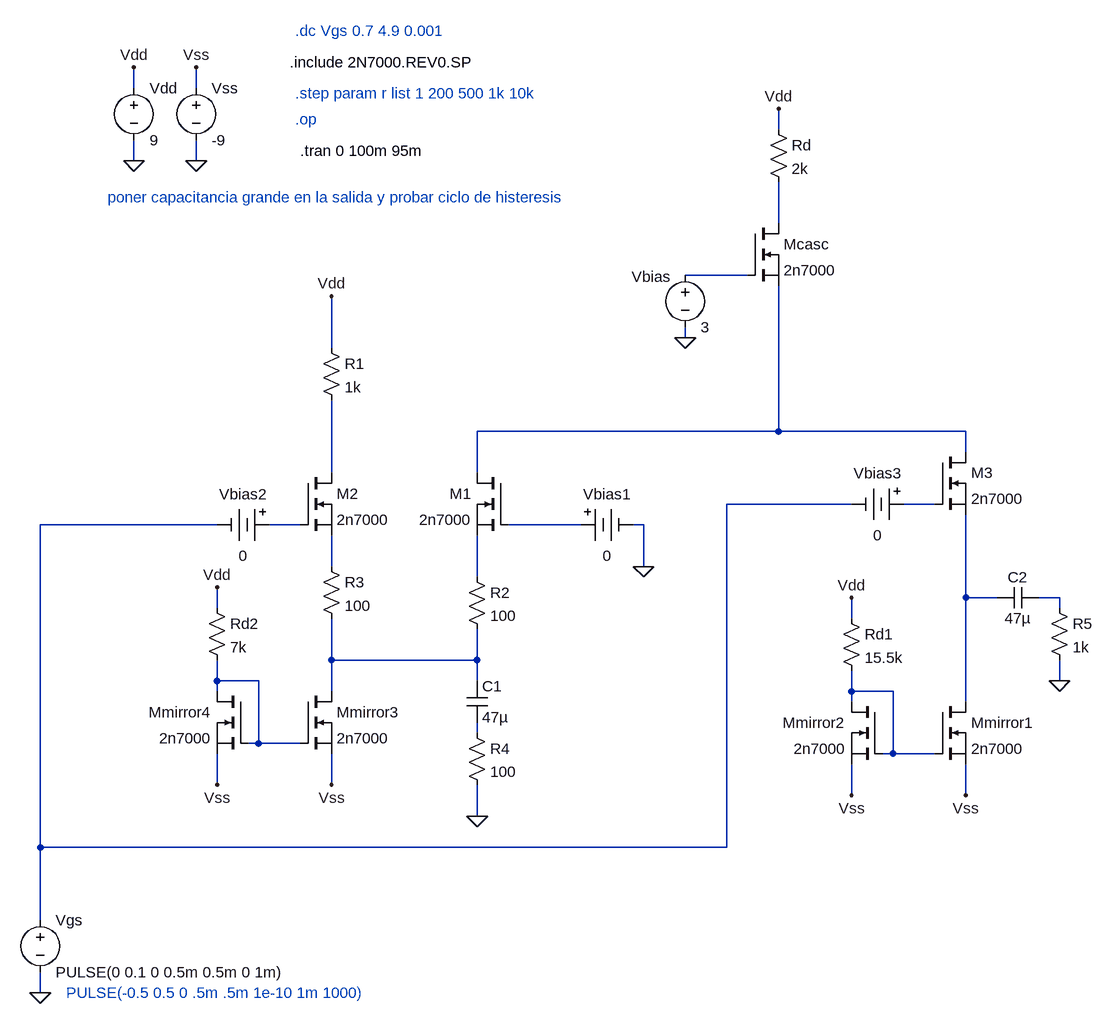
[diagram p0: schematic both gm.asc]
both gm.asc, the LTspice schematic file:
Version 4
SHEET 1 1940 1232
WIRE 400 -176 400 -208
WIRE 496 -176 496 -208
WIRE 1392 -112 1392 -144
WIRE 400 -64 400 -96
WIRE 496 -64 496 -96
WIRE 1392 32 1392 -32
WIRE 1344 112 1248 112
WIRE 1248 208 1248 192
WIRE 704 224 704 144
WIRE 1392 352 1392 128
WIRE 1392 352 928 352
WIRE 1680 352 1392 352
WIRE 1680 384 1680 352
WIRE 704 416 704 304
WIRE 928 416 928 352
WIRE 1504 464 1312 464
WIRE 1632 464 1584 464
WIRE 528 496 256 496
WIRE 656 496 608 496
WIRE 1088 496 976 496
WIRE 1184 496 1168 496
WIRE 704 560 704 512
WIRE 1184 560 1184 496
WIRE 928 576 928 512
WIRE 1680 608 1680 480
WIRE 1728 608 1680 608
WIRE 1824 608 1792 608
WIRE 528 624 528 592
WIRE 1824 624 1824 608
WIRE 1504 640 1504 608
WIRE 704 704 704 640
WIRE 928 704 928 656
WIRE 928 704 704 704
WIRE 528 736 528 704
WIRE 592 736 528 736
WIRE 928 736 928 704
WIRE 1824 736 1824 704
WIRE 528 752 528 736
WIRE 704 752 704 704
WIRE 1504 752 1504 720
WIRE 1568 752 1504 752
WIRE 1504 768 1504 752
WIRE 1680 768 1680 608
WIRE 928 816 928 800
WIRE 592 832 592 736
WIRE 592 832 576 832
WIRE 656 832 592 832
WIRE 1568 848 1568 752
WIRE 1568 848 1552 848
WIRE 1632 848 1568 848
WIRE 528 896 528 848
WIRE 704 896 704 848
WIRE 1504 912 1504 864
WIRE 1680 912 1680 864
WIRE 928 944 928 896
WIRE 256 992 256 496
WIRE 1312 992 1312 464
WIRE 1312 992 256 992
WIRE 256 1104 256 992
WIRE 256 1216 256 1184
FLAG 256 1216 0
FLAG 400 -64 0
FLAG 400 -208 Vdd
FLAG 1392 -144 Vdd
FLAG 1248 208 0
FLAG 496 -64 0
FLAG 496 -208 Vss
FLAG 528 592 Vdd
FLAG 528 896 Vss
FLAG 704 896 Vss
FLAG 704 144 Vdd
FLAG 1184 560 0
FLAG 928 944 0
FLAG 1504 608 Vdd
FLAG 1504 912 Vss
FLAG 1680 912 Vss
FLAG 1824 736 0
SYMBOL voltage 256 1088 R0
WINDOW 123 0 0 Left 2
WINDOW 39 0 0 Left 2
SYMATTR InstName Vgs
SYMATTR Value PULSE(0 0.1 0 0.5m 0.5m 0 1m)
SYMBOL voltage 400 -192 R0
WINDOW 123 0 0 Left 2
WINDOW 39 0 0 Left 2
SYMATTR InstName Vdd
SYMATTR Value 9
SYMBOL res 1376 -128 R0
SYMATTR InstName Rd
SYMATTR Value 2k
SYMBOL nmos 1344 32 R0
SYMATTR InstName Mcasc
SYMATTR Value 2n7000
SYMATTR Prefix X
SYMBOL voltage 1248 96 R0
WINDOW 0 -82 18 Left 2
WINDOW 123 0 0 Left 2
WINDOW 39 0 0 Left 2
SYMATTR InstName Vbias
SYMATTR Value 3
SYMBOL voltage 496 -192 R0
WINDOW 123 0 0 Left 2
WINDOW 39 0 0 Left 2
SYMATTR InstName Vss
SYMATTR Value -9
SYMBOL nmos 656 416 R0
SYMATTR InstName M2
SYMATTR Value 2n7000
SYMATTR Prefix X
SYMBOL battery 624 496 R90
WINDOW 0 -32 56 VBottom 2
WINDOW 3 32 56 VTop 2
SYMATTR InstName Vbias2
SYMATTR Value 0
SYMBOL nmos 656 752 R0
SYMATTR InstName Mmirror3
SYMATTR Value 2n7000
SYMATTR Prefix X
SYMBOL nmos 576 752 M0
SYMATTR InstName Mmirror4
SYMATTR Value 2n7000
SYMATTR Prefix X
SYMBOL res 512 608 R0
SYMATTR InstName Rd2
SYMATTR Value 7k
SYMBOL nmos 976 416 M0
SYMATTR InstName M1
SYMATTR Value 2n7000
SYMATTR Prefix X
SYMBOL res 688 208 R0
SYMATTR InstName R1
SYMATTR Value 1k
SYMBOL battery 1072 496 M90
WINDOW 0 -32 56 VBottom 2
WINDOW 3 32 56 VTop 2
SYMATTR InstName Vbias1
SYMATTR Value 0
SYMBOL res 912 560 R0
SYMATTR InstName R2
SYMATTR Value 100
SYMBOL res 688 544 R0
SYMATTR InstName R3
SYMATTR Value 100
SYMBOL cap 912 736 R0
SYMATTR InstName C1
SYMATTR Value 47µ
SYMBOL res 912 800 R0
SYMATTR InstName R4
SYMATTR Value 100
SYMBOL nmos 1632 768 R0
SYMATTR InstName Mmirror1
SYMATTR Value 2n7000
SYMATTR Prefix X
SYMBOL nmos 1552 768 M0
SYMATTR InstName Mmirror2
SYMATTR Value 2n7000
SYMATTR Prefix X
SYMBOL res 1488 624 R0
SYMATTR InstName Rd1
SYMATTR Value 15.5k
SYMBOL nmos 1632 384 R0
SYMATTR InstName M3
SYMATTR Value 2n7000
SYMATTR Prefix X
SYMBOL battery 1600 464 R90
WINDOW 0 -32 56 VBottom 2
WINDOW 3 32 56 VTop 2
SYMATTR InstName Vbias3
SYMATTR Value 0
SYMBOL cap 1792 592 R90
WINDOW 0 0 32 VBottom 2
WINDOW 3 32 32 VTop 2
SYMATTR InstName C2
SYMATTR Value 47µ
SYMBOL res 1808 608 R0
SYMATTR InstName R5
SYMATTR Value 1k
TEXT 648 -264 Left 2 ;.dc Vgs 0.7 4.9 0.001
TEXT 640 -216 Left 2 !.include 2N7000.REV0.SP
TEXT 648 -168 Left 2 ;.step param r list 1 200 500 1k 10k
TEXT 648 -128 Left 2 ;.op
TEXT 656 -80 Left 2 !.tran 0 100m 95m
TEXT 296 1216 Left 2 ;PULSE(-0.5 0.5 0 .5m .5m 1e-10 1m 1000)
TEXT 360 -8 Left 2 ;poner capacitancia grande en la salida y probar ciclo de histeresis

The netlist it stands for:
* both gm.asc
Vgs N005 0 PULSE(0 0.1 0 0.5m 0.5m 0 1m)
Vdd Vdd 0 9
Rd Vdd N001 2k
XMcasc N001 N002 N003 2n7000  ; pins D G S
Vbias N002 0 3
Vss Vss 0 -9
XM2 N004 N007 N009 2n7000  ; pins D G S
Vbias2 N007 N005 0
XMmirror3 N013 N014 Vss 2n7000  ; pins D G S
XMmirror4 N014 N014 Vss 2n7000  ; pins D G S
Rd2 Vdd N014 7k
XM1 N003 N008 N010 2n7000  ; pins D G S
R1 Vdd N004 1k
Vbias1 N008 0 0
R2 N010 N013 100
R3 N009 N013 100
C1 N013 N016 47µ
R4 N016 0 100
XMmirror1 N011 N015 Vss 2n7000  ; pins D G S
XMmirror2 N015 N015 Vss 2n7000  ; pins D G S
Rd1 Vdd N015 15.5k
XM3 N003 N006 N011 2n7000  ; pins D G S
Vbias3 N006 N005 0
C2 N012 N011 47µ
R5 N012 0 1k
* .dc Vgs 0.7 4.9 0.001
.include 2N7000.REV0.SP
* .step param r list 1 200 500 1k 10k
* .op
.tran 0 100m 95m
* PULSE(-0.5 0.5 0 .5m .5m 1e-10 1m 1000)
* poner capacitancia grande en la salida y probar ciclo de histeresis
.backanno
.end